# EAGLE board USBHubAndSensors (EAGLE 6.0)
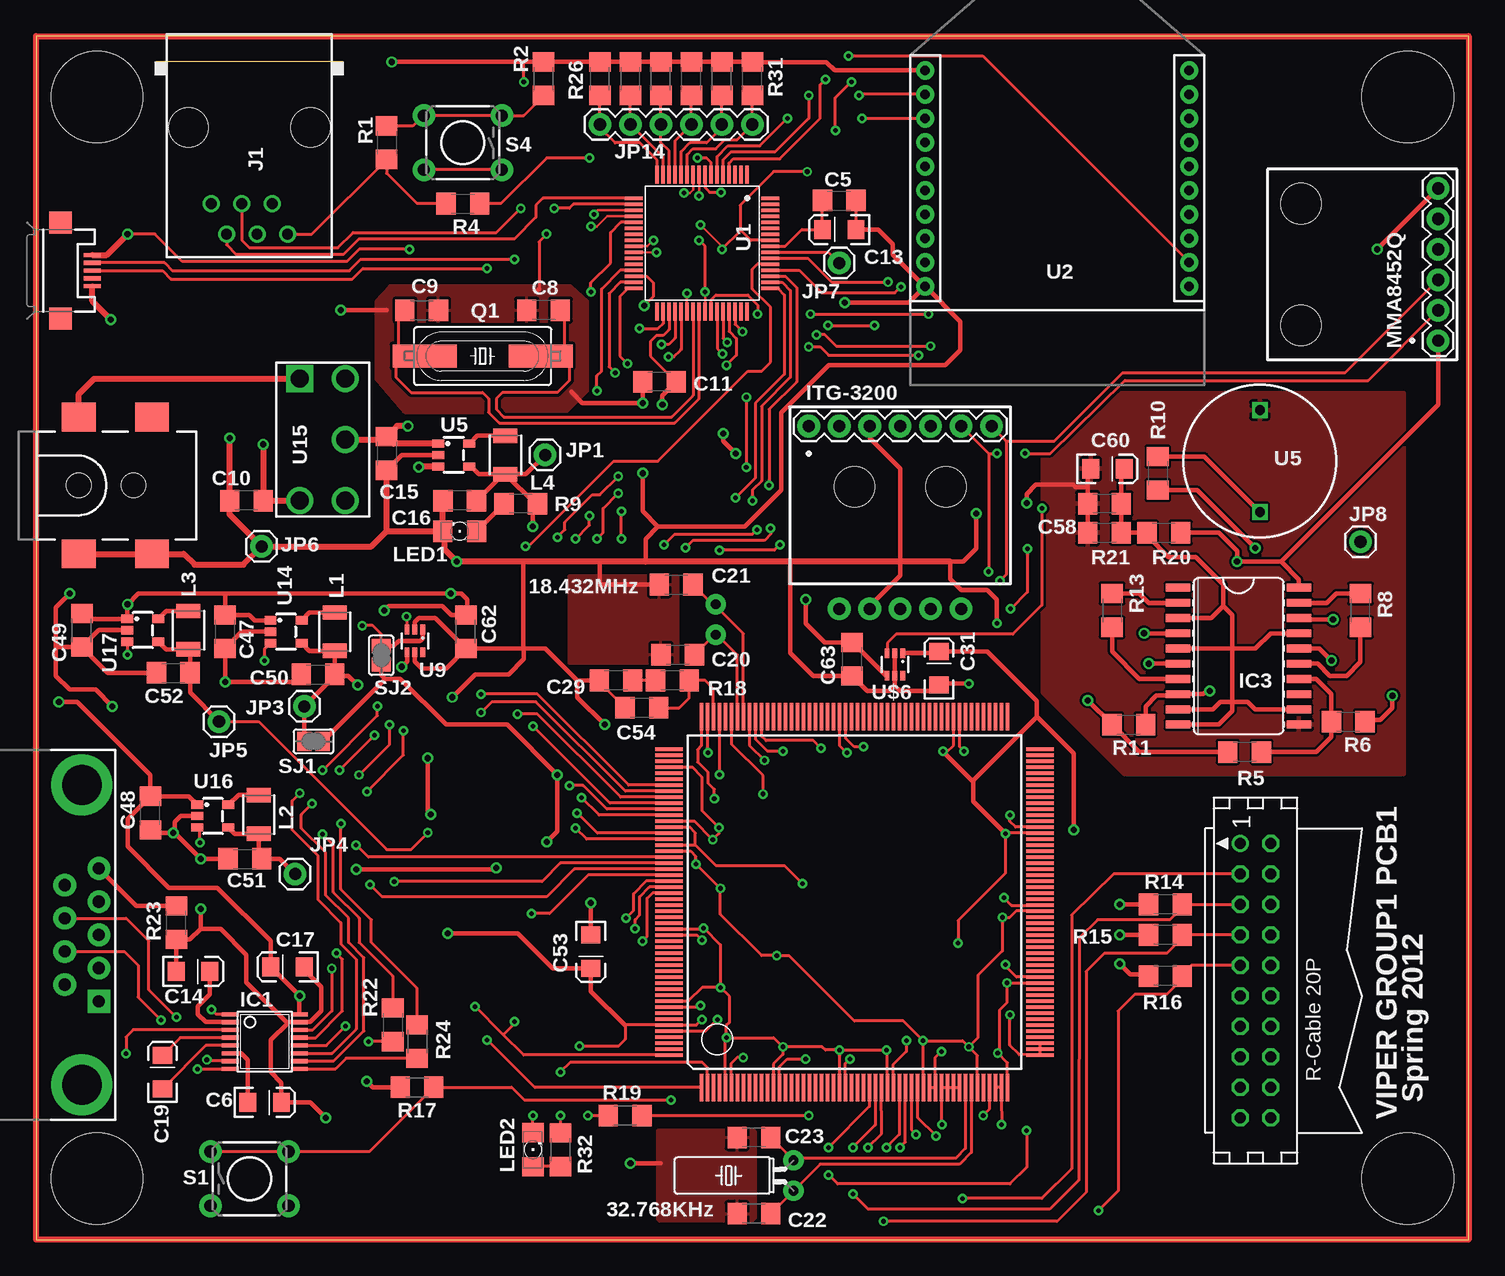
[diagram p2: board, top side]
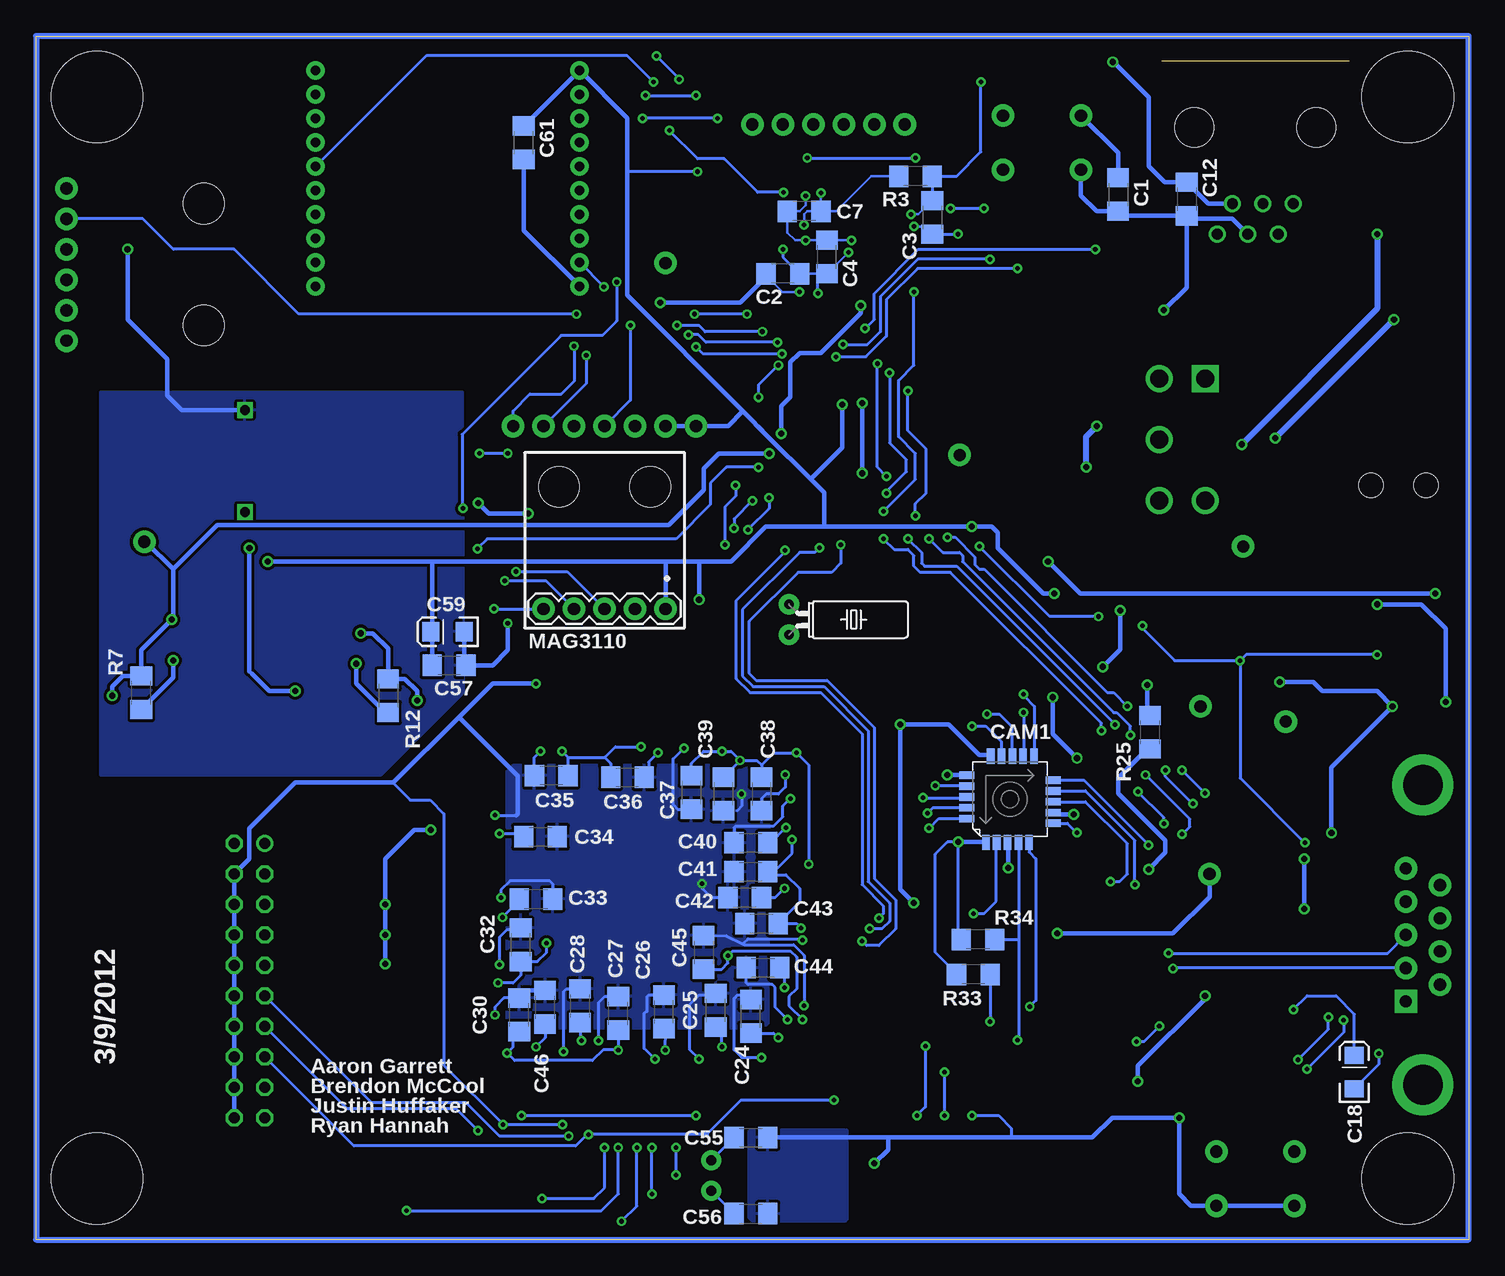
[diagram p3: board, bottom side, seen from below]

Size 119.38 x 100.33 mm. Coordinates in mm from the lower left corner, seen from the top.
Outline: 0,0 119.38,0 119.38,100.33 0,100.33 0,0
Copper layers (1*16): Top 0.035mm / dielectric 1.5mm / Bottom 0.035mm
Design rules: minimum track width 8mil, minimum drill 15mil, track to track 8mil, track to pad 8mil, pad to pad 6mil, via to via 8mil, smd to smd 8mil, copper to edge 40mil, drill to drill 8mil, minimum pad ring 10mil, minimum via ring 8mil, stop-mask expansion 4mil, vias tented up to drill 0mil, thermal gap 10mil
Holes 7.62 mm at 5.08,95.25 5.08,5.08 114.3,95.25 114.3,5.08
Holes 3.37 mm at 105.41,86.36 105.41,76.2 68.2,62.74 75.82,62.74

## Footprints (pad centres in the part's own frame; a part is rotated, then mirrored left to right if it is on the bottom)
TC38H = drill 0.813 pad 1.676: 1 -1.27,0; 2 1.27,0
1206 = smd 1.6 x 1.8: 1 -1.4,0; 2 1.4,0
EIA3216 = smd 1.4 x 1.6: A 1.4,0; C -1.4,0
TCM8230MD = smd 0.635 x 1.27: 1 2,3.6; 2 1.1,3.6; 3 0.2,3.6; 4 -0.7,3.6; 5 -1.6,3.6; 11 -2,-3.6; 12 -1.1,-3.6; 13 -0.2,-3.6; 14 0.7,-3.6; 15 1.6,-3.6 | smd 1.27 x 0.635: 6 -3.6,2; 7 -3.6,1.1; 8 -3.6,0.2; 9 -3.6,-0.7; 10 -3.6,-1.6; 16 3.6,-2; 17 3.6,-1.1; 18 3.6,-0.2; 19 3.6,0.7; 20 3.6,1.6
CON20 = drill 0.914: 1 -11.43,-1.27 | drill 0.914 octagon: 2 -11.43,1.27; 3 -8.89,-1.27; 4 -8.89,1.27; 5 -6.35,-1.27; 6 -6.35,1.27; 7 -3.81,-1.27; 8 -3.81,1.27; 9 -1.27,-1.27; 10 -1.27,1.27; 11 1.27,-1.27; 12 1.27,1.27; 13 3.81,-1.27; 14 3.81,1.27; 15 6.35,-1.27; 16 6.35,1.27; 17 8.89,-1.27; 18 8.89,1.27; 19 11.43,-1.27; 20 11.43,1.27
TSSOP16 = smd 0.35 x 1.4: 1 -2.275,-2.875; 2 -1.625,-2.875; 3 -0.975,-2.875; 4 -0.325,-2.875; 5 0.325,-2.875; 6 0.975,-2.875; 7 1.625,-2.875; 8 2.275,-2.875; 9 2.275,2.875; 10 1.625,2.875; 11 0.975,2.875; 12 0.325,2.875; 13 -0.325,2.875; 14 -0.975,2.875; 15 -1.625,2.875; 16 -2.275,2.875
SO20L = smd 0.66 x 2.032: 1 -5.715,-5.029; 2 -4.445,-5.029; 3 -3.175,-5.029; 4 -1.905,-5.029; 5 -0.635,-5.029; 6 0.635,-5.029; 7 1.905,-5.029; 8 3.175,-5.029; 9 4.445,-5.029; 10 5.715,-5.029; 11 5.715,5.029; 12 4.445,5.029; 13 3.175,5.029; 14 1.905,5.029; 15 0.635,5.029; 16 -0.635,5.029; 17 -1.905,5.029; 18 -3.175,5.029; 19 -4.445,5.029; 20 -5.715,5.029
RJ11-NO_SHIELD = drill 0.9 pad 1.4: 1 -3.175,8.89; 2 -1.905,6.35; 3 -0.635,8.89; 4 0.635,6.35; 5 1.905,8.89; 6 3.175,6.35 | hole 3.251: -5.08,0; 5.08,0
POWER_JACK_SMD = smd 2.8 x 2.4: GND 0,-5.7; P$4 6.1,-5.7; VIN0 0,5.7; VIN1 6.1,5.7 | hole 2.032: 0,0; 4.572,0
1X01 = drill 1.016 pad 1.88: 1 0,0
1X07 = drill 1.016 pad 1.88: 1 0,0; 2 2.54,0; 3 5.08,0; 4 7.62,0; 5 10.16,0; 6 12.7,0; 7 15.24,0
1X06 = drill 1.016 pad 1.88: 1 0,0; 2 2.54,0; 3 5.08,0; 4 7.62,0; 5 10.16,0; 6 12.7,0
1X05 = drill 1.016 pad 1.88: 1 0,0; 2 2.54,0; 3 5.08,0; 4 7.62,0; 5 10.16,0
1210 = smd 1.2 x 2: 1 -1.6,0; 2 1.6,0
FKIT-LED-1206 = smd 1.6 x 1.803: A -1.422,0; C 1.422,0
HC49UP = smd 5.334 x 1.93: 1 -4.826,0; 2 4.826,0
TACTILE-PTH = drill 1.016 pad 1.88: 1 -3.251,2.261; 2 3.251,2.261; 3 -3.251,-2.261; 4 3.251,-2.261
SJ = smd 1.168 x 1.6: 1 -0.762,0; 2 0.762,0
64-TQFP = smd 1.5 x 0.3: P$1 -5.7,3.75; P$2 -5.7,3.25; P$3 -5.7,2.75; P$4 -5.7,2.25; P$5 -5.7,1.75; P$6 -5.7,1.25; P$7 -5.7,0.75; P$8 -5.7,0.25; P$9 -5.7,-0.25; P$10 -5.7,-0.75; P$11 -5.7,-1.25; P$12 -5.7,-1.75; P$13 -5.7,-2.25; P$14 -5.7,-2.75; P$15 -5.7,-3.25; P$16 -5.7,-3.75; P$33 5.7,-3.75; P$34 5.7,-3.25; P$35 5.7,-2.75; P$36 5.7,-2.25; P$37 5.7,-1.75; P$38 5.7,-1.25; P$39 5.7,-0.75; P$40 5.7,-0.25; P$41 5.7,0.25; P$42 5.7,0.75; P$43 5.7,1.25; P$44 5.7,1.75; P$45 5.7,2.25; P$46 5.7,2.75; P$47 5.7,3.25; P$48 5.7,3.75 | smd 0.3 x 1.5: P$17 -3.75,-5.7; P$18 -3.25,-5.7; P$19 -2.75,-5.7; P$20 -2.25,-5.7; P$21 -1.75,-5.7; P$22 -1.25,-5.7; P$23 -0.75,-5.7; P$24 -0.25,-5.7; P$25 0.25,-5.7; P$26 0.75,-5.7; P$27 1.25,-5.7; P$28 1.75,-5.7; P$29 2.25,-5.7; P$30 2.75,-5.7; P$31 3.25,-5.7; P$32 3.75,-5.7; P$49 3.75,5.7; P$50 3.25,5.7; P$51 2.75,5.7; P$52 2.25,5.7; P$53 1.75,5.7; P$54 1.25,5.7; P$55 0.75,5.7; P$56 0.25,5.7; P$57 -0.25,5.7; P$58 -0.75,5.7; P$59 -1.25,5.7; P$60 -1.75,5.7; P$61 -2.25,5.7; P$62 -2.75,5.7; P$63 -3.25,5.7; P$64 -3.75,5.7
XBEE-SILK = drill 0.8 pad 1.524: 1 -11,20; 2 -11,18; 3 -11,16; 4 -11,14; 5 -11,12; 6 -11,10; 7 -11,8; 8 -11,6; 9 -11,4; 10 -11,2; 11 11,2; 12 11,4; 13 11,6; 14 11,8; 15 11,10; 16 11,12; 17 11,14; 18 11,16; 19 11,18; 20 11,20
40TR = drill 0.8 square: P$1 0,4.25; P$2 0,-4.25
SOT23-5 = smd 0.686 x 0.991: P$1 -0.953,-1.295; P$2 0,-1.295; P$3 0.953,-1.295; P$4 0.953,1.295; P$5 -0.953,1.295
SC-70-6 = smd 0.4 x 0.8: P$1 -0.65,-0.95; P$2 0,-0.95; P$3 0.65,-0.95; P$4 0.65,0.95; P$5 0,0.95; P$6 -0.65,0.95
PQFP208 = smd 0.3 x 2.286: 1 -12.75,-15.458; 2 -12.25,-15.458; 3 -11.75,-15.458; 4 -11.25,-15.458; 5 -10.75,-15.458; 6 -10.25,-15.458; 7 -9.75,-15.458; 8 -9.25,-15.458; 9 -8.75,-15.458; 10 -8.25,-15.458; 11 -7.75,-15.458; 12 -7.25,-15.458; 13 -6.75,-15.458; 14 -6.25,-15.458; 15 -5.75,-15.458; 16 -5.25,-15.458; 17 -4.75,-15.458; 18 -4.25,-15.458; 19 -3.75,-15.458; 20 -3.25,-15.458; 21 -2.75,-15.458; 22 -2.25,-15.458; 23 -1.75,-15.458; 24 -1.25,-15.458; 25 -0.75,-15.458; 26 -0.25,-15.458; 27 0.25,-15.458; 28 0.75,-15.458; 29 1.25,-15.458; 30 1.75,-15.458; 31 2.25,-15.458; 32 2.75,-15.458; 33 3.25,-15.458; 34 3.75,-15.458; 35 4.25,-15.458; 36 4.75,-15.458; 37 5.25,-15.458; 38 5.75,-15.458; 39 6.25,-15.458; 40 6.75,-15.458; 41 7.25,-15.458; 42 7.75,-15.458; 43 8.25,-15.458; 44 8.75,-15.458; 45 9.25,-15.458; 46 9.75,-15.458; 47 10.25,-15.458; 48 10.75,-15.458; 49 11.25,-15.458; 50 11.75,-15.458; 51 12.25,-15.458; 52 12.75,-15.458; 105 12.75,15.458; 106 12.25,15.458; 107 11.75,15.458; 108 11.25,15.458; 109 10.75,15.458; 110 10.25,15.458; 111 9.75,15.458; 112 9.25,15.458; 113 8.75,15.458; 114 8.25,15.458; 115 7.75,15.458; 116 7.25,15.458; 117 6.75,15.458; 118 6.25,15.458; 119 5.75,15.458; 120 5.25,15.458; 121 4.75,15.458; 122 4.25,15.458; 123 3.75,15.458; 124 3.25,15.458; 125 2.75,15.458; 126 2.25,15.458; 127 1.75,15.458; 128 1.25,15.458; 129 0.75,15.458; 130 0.25,15.458; 131 -0.25,15.458; 132 -0.75,15.458; 133 -1.25,15.458; 134 -1.75,15.458; 135 -2.25,15.458; 136 -2.75,15.458; 137 -3.25,15.458; 138 -3.75,15.458; 139 -4.25,15.458; 140 -4.75,15.458; 141 -5.25,15.458; 142 -5.75,15.458; 143 -6.25,15.458; 144 -6.75,15.458; 145 -7.25,15.458; 146 -7.75,15.458; 147 -8.25,15.458; 148 -8.75,15.458; 149 -9.25,15.458; 150 -9.75,15.458; 151 -10.25,15.458; 152 -10.75,15.458; 153 -11.25,15.458; 154 -11.75,15.458; 155 -12.25,15.458; 156 -12.75,15.458 | smd 2.286 x 0.3: 53 15.458,-12.75; 54 15.458,-12.25; 55 15.458,-11.75; 56 15.458,-11.25; 57 15.458,-10.75; 58 15.458,-10.25; 59 15.458,-9.75; 60 15.458,-9.25; 61 15.458,-8.75; 62 15.458,-8.25; 63 15.458,-7.75; 64 15.458,-7.25; 65 15.458,-6.75; 66 15.458,-6.25; 67 15.458,-5.75; 68 15.458,-5.25; 69 15.458,-4.75; 70 15.458,-4.25; 71 15.458,-3.75; 72 15.458,-3.25; 73 15.458,-2.75; 74 15.458,-2.25; 75 15.458,-1.75; 76 15.458,-1.25; 77 15.458,-0.75; 78 15.458,-0.25; 79 15.458,0.25; 80 15.458,0.75; 81 15.458,1.25; 82 15.458,1.75; 83 15.458,2.25; 84 15.458,2.75; 85 15.458,3.25; 86 15.458,3.75; 87 15.458,4.25; 88 15.458,4.75; 89 15.458,5.25; 90 15.458,5.75; 91 15.458,6.25; 92 15.458,6.75; 93 15.458,7.25; 94 15.458,7.75; 95 15.458,8.25; 96 15.458,8.75; 97 15.458,9.25; 98 15.458,9.75; 99 15.458,10.25; 100 15.458,10.75; 101 15.458,11.25; 102 15.458,11.75; 103 15.458,12.25; 104 15.458,12.75; 157 -15.458,12.75; 158 -15.458,12.25; 159 -15.458,11.75; 160 -15.458,11.25; 161 -15.458,10.75; 162 -15.458,10.25; 163 -15.458,9.75; 164 -15.458,9.25; 165 -15.458,8.75; 166 -15.458,8.25; 167 -15.458,7.75; 168 -15.458,7.25; 169 -15.458,6.75; 170 -15.458,6.25; 171 -15.458,5.75; 172 -15.458,5.25; 173 -15.458,4.75; 174 -15.458,4.25; 175 -15.458,3.75; 176 -15.458,3.25; 177 -15.458,2.75; 178 -15.458,2.25; 179 -15.458,1.75; 180 -15.458,1.25; 181 -15.458,0.75; 182 -15.458,0.25; 183 -15.458,-0.25; 184 -15.458,-0.75; 185 -15.458,-1.25; 186 -15.458,-1.75; 187 -15.458,-2.25; 188 -15.458,-2.75; 189 -15.458,-3.25; 190 -15.458,-3.75; 191 -15.458,-4.25; 192 -15.458,-4.75; 193 -15.458,-5.25; 194 -15.458,-5.75; 195 -15.458,-6.25; 196 -15.458,-6.75; 197 -15.458,-7.25; 198 -15.458,-7.75; 199 -15.458,-8.25; 200 -15.458,-8.75; 201 -15.458,-9.25; 202 -15.458,-9.75; 203 -15.458,-10.25; 204 -15.458,-10.75; 205 -15.458,-11.25; 206 -15.458,-11.75; 207 -15.458,-12.25; 208 -15.458,-12.75
G-197 = drill 1.5 square: P$1 -5.08,-1.905 | drill 1.5: P$2 5.08,-1.905; P$3 5.08,1.905; P$4 -5.08,1.905; P$5 0,1.905
DB9 = drill 1.016 pad 1.88 square: 1 -5.54,-1.42 | drill 1.016 pad 1.88: 2 -2.77,-1.42; 3 0,-1.42; 4 2.77,-1.42; 5 5.54,-1.42; 6 -4.15,1.42; 7 -1.38,1.42; 8 1.38,1.42; 9 4.15,1.42 | drill 3.302 pad 5.08: G1 -12.5,0; G2 12.5,0
USB-MICROB = smd 0.35 x 1.4: D+ 0,2.65; D- -0.65,2.65; GND 1.3,2.65; ID 0.65,2.65; VBUS -1.3,2.65 | smd 1.8 x 1.9: MT1 -4,0; MT2 4,0

## Placement (x,y rotation side)
300-8444-ND  18.432MHz  [TC38H]  56.64,51.69 270 bottom
535-9034-ND  32.768kHz  [TC38H]  63.12,5.33 90 top
C1  0.1uf  [1206]  29.21,87.12 270 bottom
C2  0.1uf  [1206]  57.15,80.52 180 bottom
C3  0.1uf  [1206]  44.7,85.22 270 bottom
C4  0.1uf  [1206]  53.47,81.92 90 bottom
C5  0.1uf  [1206]  66.93,86.61 0 top
C6  0.1uf  [EIA3216]  19.05,11.43 0 top
C7  0.1uf  [1206]  55.37,85.72 180 bottom
C8  22pf  [1206]  42.29,77.47 180 top
C9  22pf  [1206]  32.13,77.47 0 top
C10  1uf  [1206]  17.53,61.59 180 top
C11  0.1uf  [1206]  51.94,71.5 180 top
C12  0.1uf  [1206]  23.5,86.74 270 bottom
C13  10uf  [EIA3216]  66.93,84.2 180 top
C14  0.1uf  [EIA3216]  13.08,22.35 0 top
C15  4.7uF  [1206]  29.21,65.53 270 top
C16  10uf  [1206]  35.31,61.59 180 top
C17  0.1uf  [EIA3216]  20.95,22.73 180 top
C18  0.1uf  [EIA3216]  9.53,13.97 90 bottom
C19  0.1uf  [EIA3216]  10.54,13.97 90 top
C20  10pF  [1206]  53.47,48.77 0 top
C21  10pF  [1206]  53.34,54.61 0 top
C22  10pF  [1206]  59.82,2.16 180 top
C23  10pF  [1206]  59.82,8.51 180 top
C24  100nF  [1206]  59.82,18.61 90 bottom
C25  100nF  [1206]  62.74,19.11 90 bottom
C26  100nF  [1206]  67.06,18.99 90 bottom
C27  100nF  [1206]  70.87,18.86 90 bottom
C28  100nF  [1206]  74.04,19.49 90 bottom
C29  10nf  [1206]  48.32,46.61 180 top
C30  100nF  [1206]  79.12,18.73 90 bottom
C31  10uf  [EIA3216]  75.25,47.62 90 top
C32  100nF  [1206]  78.99,24.57 90 bottom
C33  100nF  [1206]  77.72,28.38 0 bottom
C34  100nF  [1206]  77.34,33.59 0 bottom
C35  100nF  [1206]  76.45,38.67 180 bottom
C36  100nF  [1206]  70.1,38.54 0 bottom
C37  100nF  [1206]  64.77,37.27 270 bottom
C38  100nF  [1206]  58.93,37.15 270 bottom
C39  100nF  [1206]  62.1,37.15 270 bottom
C40  100nF  [1206]  59.82,33.08 0 bottom
C41  100nF  [1206]  59.82,30.67 0 bottom
C42  100nF  [1206]  60.33,28.51 0 bottom
C43  100nF  [1206]  58.93,26.35 0 bottom
C44  100nF  [1206]  58.8,22.67 0 bottom
C45  100nF  [1206]  63.75,23.94 270 bottom
C46  100nF  [1206]  76.96,19.37 90 bottom
C47  4.7uF  [1206]  15.75,50.67 90 top
C48  4.7uF  [1206]  9.53,35.56 90 top
C49  4.7uF  [1206]  3.81,50.8 90 top
C50  10uF  [1206]  23.5,47.12 0 top
C51  10uf  [1206]  17.4,31.75 0 top
C52  10uf  [1206]  11.43,47.24 0 top
C53  10uf  [EIA3216]  46.23,24 270 top
C54  1nf  [1206]  50.48,44.32 180 top
C55  7pF  [1206]  59.82,8.51 0 bottom
C56  7pF  [1206]  59.82,2.16 0 bottom
C57  0.1uf  [1206]  84.96,47.88 0 bottom
C58  0.1uf  [1206]  89.03,61.34 180 top
C59  4.7uf  [EIA3216]  85.09,50.67 180 bottom
C60  4.7uf  [EIA3216]  89.28,64.26 0 top
C61  0.1uf  [1206]  78.74,91.44 90 bottom
C62  0.1uf  [1206]  35.81,50.67 90 top
C63  0.1uf  [1206]  68.01,48.39 90 top
CAM1  TCM8230MD  [TCM8230MD]  38.23,36.7 180 bottom
CON1  [CON20]  101.6,21.59 270 top
IC1  MAX3232CUE  [TSSOP16]  19.05,16.51 270 top
IC3  MAX275ACPBCWP  [SO20L]  100.2,48.64 270 top
J1  RJ11-6L-B  [RJ11-NO_SHIELD]  17.78,92.71 180 top
J2  POWER_JACKSMD  [POWER_JACK_SMD]  3.56,62.87 0 top
JP1  M01PTH  [1X01]  42.42,65.41 0 top
JP3  M01PTH  [1X01]  22.35,44.45 0 top
JP4  M01PTH  [1X01]  21.59,30.48 0 top
JP4_ITG-3200  [1X07]  64.39,67.82 0 top
JP5  M01PTH  [1X01]  15.24,43.18 0 top
JP5_MMA8452Q  [1X06]  116.84,74.93 90 top
JP6  M01PTH  [1X01]  18.8,57.78 0 top
JP6_MAG3110  [1X05]  66.93,52.58 180 bottom
JP7  M01PTH  [1X01]  66.93,81.41 180 top
JP8  M01PTH  [1X01]  110.36,58.17 0 top
JP14  [1X06]  46.99,92.96 0 top
L1  2.2uH  [1210]  24.89,50.67 270 top
L2  2.2uH  [1210]  18.54,35.43 270 top
L3  2.2uH  [1210]  12.7,50.8 270 top
L4  2.2uH  [1210]  39.12,65.41 270 top
LED1  [FKIT-LED-1206]  35.31,59.05 180 top
LED2  [FKIT-LED-1206]  41.4,7.49 90 top
Q1  8MHz  [HC49UP]  37.21,73.66 0 top
R1  370  [1206]  29.21,91.44 270 top
R2  10k  [1206]  42.29,96.77 90 top
R3  10  [1206]  46.1,88.65 180 bottom
R4  100  [1206]  35.56,86.36 0 top
R5  50k  [1206]  100.71,40.64 180 top
R6  100k  [1206]  109.35,43.18 0 top
R7  45k  [1206]  110.62,45.59 90 bottom
R8  50k  [1206]  110.36,52.45 90 top
R9  65  [1206]  40.39,61.34 180 top
R10  50k  [1206]  93.47,63.88 270 top
R11  100k  [1206]  91.06,42.93 0 top
R12  45k  [1206]  90.04,45.34 270 bottom
R13  50k  [1206]  89.66,52.45 270 top
R14  100K  [1206]  94.11,27.94 180 top
R15  100K  [1206]  94.11,25.4 180 top
R16  100K  [1206]  94.11,21.97 180 top
R17  1K  [1206]  31.75,12.7 0 top
R18  100K  [1206]  53.02,46.61 180 top
R19  100k  [1206]  49.09,10.35 0 top
R20  4.7k  [1206]  93.98,58.93 0 top
R21  4.7k  [1206]  89.03,58.93 0 top
R22  470  [1206]  29.72,17.91 270 top
R23  10  [1206]  11.68,26.42 90 top
R24  470  [1206]  31.75,16.51 270 top
R25  100K  [1206]  26.54,42.29 90 bottom
R26  10k  [1206]  46.99,96.77 90 top
R27  10k  [1206]  49.53,96.77 90 top
R28  10k  [1206]  52.07,96.77 90 top
R29  10k  [1206]  54.61,96.77 90 top
R30  10k  [1206]  57.15,96.77 90 top
R31  10k  [1206]  59.69,96.77 90 top
R32  1k  [1206]  43.69,7.49 270 top
R33  10k  [1206]  41.27,22.1 180 bottom
R34  10k  [1206]  40.89,25.02 180 bottom
S1  [TACTILE-PTH]  17.78,5.08 0 top
S4  [TACTILE-PTH]  35.56,91.44 180 top
SJ1  [SJ]  23.11,41.53 180 top
SJ2  [SJ]  28.77,48.7 90 top
U$1  PIC32MX534F06HTQFP  [64-TQFP]  55.5,83.06 270 top
U$2  XBEE-1B2  [XBEE-SILK]  85.09,77.47 0 top
U$5  40TR-12B  [40TR]  101.98,64.9 0 top
U$5_LM3671MF-3.3  LM36715  [SOT23-5]  34.8,65.41 270 top
U$6  MIC94061YC6  [SC-70-6]  71.56,47.94 180 top
U$7  AT91SAM9XE256  [PQFP208]  68.2,28.13 0 top
U$9  MIC94061YC6  [SC-70-6]  31.56,49.91 180 top
U$14_LM3671MF-2.8  LM36715  [SOT23-5]  20.83,50.67 270 top
U$15  G-107PLUG-IN  [G-197]  23.88,66.67 270 top
U$16_LM3671MF-1.8  LM36715  [SOT23-5]  14.73,35.31 270 top
U$17_LM3671-1.5  LM36715  [SOT23-5]  8.89,50.8 270 top
X1  [DB9]  3.81,25.4 90 top
X2  USB-MICROB  [USB-MICROB]  2.03,80.77 270 top

## Tracks (layer width: path | path; a pad name or v marks a point on that pad's centre or on a via)
1.8V  (via drill 0.38, 0.51)
  Top 0.254: U$7.77 81.67,27.38 81.15,26.86 v80.52,26.86 80.52,24.07 78.49,22.04 78.49,16.83 v77.72,16.07 | v77.72,16.07 78.45,15.34 U$7.47 | v73.91,16.57 77.22,16.57 v77.72,16.07 | C53.A | v45.97,10.35 R19.1 | v45.28,16.13 48.51,16.13 49.09,16.7 49.09,17.84 49.12,17.88 U$7.203 55.03,17.88 v55.5,18.35 | v62.23,40.7 60.96,40.7 59.94,41.72 59.95,41.72 U$7.147 | U$7.148 59.45,41.2 v60.71,39.94 | U$7.155 55.95,40.63 v56.01,40.58 | U$7.174 54.55,32.38 54.99,31.94 v54.99,31.3 v57.02,29.27 57.02,27.11 60.45,23.69 v61.72,23.69 62.74,23.69 68.2,18.22 72.26,18.22 v73.91,16.57 | U$7.38 73.95,16.54 v73.91,16.57
  Top 0.381: U$16_LM3671MF-1.8.P$4 16.55,33.83 L2.2 18.54,32.38 C51.2 20.32,31.75 JP4.1 | v34.29,25.53 40.13,25.53 43.05,22.61 C53.A | C53.A 46.23,20.7 49.09,17.84
  Bottom 0.254: C33.1 79.12,28.25 v80.52,26.86 | C46.1 76.96,16.83 v77.72,16.07 | C28.1 74.04,16.7 v73.91,16.57 | v54.99,31.3 54.99,39.56 v56.01,40.58 57.91,40.58 58.93,39.56 | v45.28,16.13 45.28,11.05 v45.97,10.35 | C37.1 64.77,39.69 63.75,40.7 v62.23,40.7 61.47,40.7 v60.71,39.94 | C39.1 v60.71,39.94 | v60.71,39.94 59.31,39.94 58.93,39.56 | 58.93,39.56 C38.1 | v57.02,29.27 57.78,28.51 C42.2 | v55.5,18.35 56.64,19.49 56.64,20.26 56.01,20.89 56.01,23.56 56.52,24.07 61.34,24.07 v61.72,23.69 61.72,23.05 62.23,22.54 C45.2
  Bottom 0.381: JP4.1 21.59,28.57 24.64,25.53 v34.29,25.53
2.8V  (via drill 0.51)
  Top 0.381: U$14_LM3671MF-2.8.P$4 22.77,49.07 L1.2 C50.2 24.89,46.99 | SJ1.2 JP3.1 24.89,46.99 | 24.89,46.99 26.03,46.99 v26.8,46.23
  Bottom 0.381: v26.8,46.23 26.8,43.95 R25.2
3.3V  (via drill 0.38, 0.51)
  Top 0.203: v54.23,78.87 U$1.P$38 | v51.69,82.3 U$1.P$26 | U$1.P$19 46.82,85.81 v46.48,85.47 | v57.15,82.55 57.15,82.8 v55.37,84.58 | U$1.P$10 54.75,87.52 54.48,87.25 v53.98,87.25
  Top 0.254: v64.26,89.03 61.47,89.03 58.67,86.23 58.67,84.2 | 58.67,84.2 59.57,83.31 U$1.P$57 | 58.67,84.2 58.67,84.07 v57.15,82.55 | v40.64,96.52 40.64,98.17 | U$1.P$35 52.75,75.86 52.26,75.37 51.69,75.37 51.18,74.87 51.18,73.66 C11.1
  Top 0.381: 36.91,61.59 C16.1 38.92,63.8 | 15.75,53.85 v34.54,53.85 35.43,53.85 35.94,53.34 35.94,52.2 C62.2 34.6,52.07 33.85,52.83 29.4,52.83 v29.02,52.45 | 15.75,53.85 C47.2 17.78,52.07 18.22,51.63 U$14_LM3671MF-2.8.P$1 | 15.75,53.85 8.51,53.85 v7.62,52.96 7.59,52.93 U$17_LM3671-1.5.P$1 4.45,51.75 4.13,52.07 3.94,52.07 C49.2 | C48.2 12.73,36.96 U$16_LM3671MF-1.8.P$1 | R17.1 28.07,12.7 v27.56,13.21 | v30.48,47.75 30.91,48.18 U$9.P$4 | v64.14,53.34 64.14,51.37 65.72,49.79 C63.2 | C63.2 68.12,49.79 | 74.11,97.47 U$2.1 66.55,97.47 65.85,98.17 R31.2 R30.2 R29.2 R28.2 R27.2 R26.2 R2.2 40.64,98.17 v29.66,98.17 v29.65,98.17 | v41.4,59.44 41.4,60.96 R9.1 41.58,61.34 L4.2 | L4.2 40.82,63.8 JP1.1 | L4.2 38.92,63.8 | U$6.P$4 70.86,46.99 68.07,49.78 C63.2 | R20.2 98.55,58.93 100.08,57.4 v100.08,56.52 103.76,56.52 | IC3.20 105.23,55.04 103.76,56.52 | JP5_MMA8452Q.1 116.84,69.6 103.76,56.52 | v1.91,44.83 3.43,44.83 9.53,38.73 C48.2 | C48.2 7.62,35.05 7.62,32.77 11.05,29.34 15.11,29.34 19.55,24.89 C17.A v21.97,20.32 21.93,20.28 IC1.16 | v52.2,69.6 52.2,70.36 C11.1 | 38.92,63.8 36.91,63.8 36.26,64.45 U$5_LM3671MF-3.3.P$4
  Bottom 0.203: v46.48,85.47 45.85,85.47 C3.1 | C7.1 52.7,85.72 49.78,88.65 R3.2 | C7.1 v53.97,87.25 v53.98,87.25 | v51.69,82.3 v51.69,82.29 C4.1 | 54.23,79.75 C4.1 | C2.1 C4.1 | C7.1 55.12,85.72 55.37,85.47 v55.37,84.58
  Bottom 0.254: C3.1 R3.1 42.67,88.65 40.64,90.68 v40.64,96.52 | v57.15,82.55 57.15,81.92 C2.1 | v64.26,89.03 69.98,89.03 70.1,88.9 | v54.23,78.87 54.23,79.75
  Bottom 0.381: v1.91,44.83 1.91,50.93 3.94,52.96 v7.62,52.96 | 53.72,59.44 v41.4,59.44 39.75,59.44 39.24,58.93 39.24,57.66 35.43,53.85 v34.54,53.85 | 60.48,69.06 70.1,78.74 70.1,88.9 70.1,93.48 U$2.1 78.72,92.84 C61.2 | 60.48,69.06 58.39,66.96 | 58.39,66.96 54.84,63.39 | v52.2,69.6 52.2,66.03 54.84,63.39 | 63.11,56.52 61.47,56.52 58.56,59.44 53.72,59.44 | 63.11,56.52 64.14,56.52 v64.14,53.34 | 66.93,56.52 JP6_MAG3110.1 | C57.1 86.36,50.55 C59.A 86.36,50.8 86.36,56.52 | 59.25,67.82 58.39,66.96 | v29.02,52.45 29.02,49.21 v30.48,47.75 | J1.2 21.71,86.36 C12.1 25.34,88.14 26.67,89.47 26.67,95.25 29.59,98.17 v29.65,98.17 | v100.08,56.52 86.36,56.52 | 86.36,56.52 66.93,56.52 | 66.93,56.52 63.11,56.52 | 54.84,63.39 53.72,62.27 53.72,59.44 | JP4_ITG-3200.2 JP4_ITG-3200.1 61.72,67.82 60.48,69.06 | v21.97,20.32 21.97,20.07 27.56,14.48 v27.56,13.21
5V  (via drill 0.51)
  Top 0.381: 31.94,64.45 v31.88,64.39
  Top 0.508: U$5_LM3671MF-3.3.P$3 31.94,64.45 | U$5_LM3671MF-3.3.P$1 29.79,66.36 C15.1 | v30.99,67.82 30.1,67.82 C15.1 | U$15.P$5 28.95,66.67 C15.1
  Bottom 0.508: v31.88,64.39 31.88,66.93 v30.99,67.82
AN15  (via drill 0.51)
  Top 0.254: U$1.P$30 50.88,80.31 51.44,79.76 51.44,78.61 v50.67,77.85
  Top 0.381: v108.08,51.69 105.36,51.69 IC3.18 | v57.28,67.18 57.28,66.55 v58.29,65.53 | v113.03,45.34 113.03,44.32 112.01,43.31 110.87,43.31 R6.2
  Bottom 0.381: JP8.1 110.24,58.17 107.95,55.88 | 107.95,55.88 104.27,59.56 66.67,59.56 63.75,62.48 63.75,64.26 62.48,65.53 v58.29,65.53 | v50.67,77.85 50.67,77.22 53.98,73.91 55.75,73.91 56.52,73.15 56.52,70.23 57.28,69.47 v57.28,67.18 | 107.95,55.88 107.95,51.82 v108.08,51.69 110.62,49.15 R7.2 112.14,46.99 113.03,46.1 v113.03,45.34
CAM3.3V  (via drill 0.38)
  Top 0.254: v19.05,48.26 19.05,49.24 U$14_LM3671MF-2.8.P$3 | U$17_LM3671-1.5.P$3 7.59,48.79 v7.62,48.77 | v13.65,33.08 13.65,34.14 U$16_LM3671MF-1.8.P$3 | SJ2.2 28.77,50.48 28.07,51.18 v27.18,51.18
  Top 0.381: U$9.P$1 32.21,50.12 32,49.91 30.23,49.91 29.78,49.47 SJ2.2
  Bottom 0.254: v19.05,48.26 24.51,48.26 27.18,50.93 v27.18,51.18 | v7.62,48.77 18.54,48.77 v19.05,48.26 | v19.05,48.26 19.05,38.48 v13.65,33.08
CTSDATA  (via drill 0.38)
  Top 0.254: IC1.7 14.32,14.88 v14.22,14.99 | v11.68,18.54 9.4,20.83 9.4,24.89 7.51,26.78 X1.8
  Bottom 0.254: v14.22,14.99 11.68,17.53 v11.68,18.54
GND  (via drill 0.38, 0.51)
  Top 0.203: v55.75,78.99 U$1.P$41 | U$1.P$20 47.59,85.31 46.74,84.45 v46.23,84.45 | v55.24,87 U$1.P$9 | U$1.P$25 50.93,82.81 v51.44,83.31
  Top 0.254: R23.1 | C13.C C5.2 | v80.77,22.92 80.77,22.8 81.69,21.88 U$7.66 | U$7.55 U$7.54 U$7.53 81.92,15.43 81.15,16.19 v81.15,18.73 | U$7.50 U$7.51 80.45,11.82 v80.45,9.59 | v80.64,28.51 81.28,27.88 83.14,27.88 U$7.78 | 83.12,34.38 U$7.91 81.63,34.38 81.15,34.86 v81.15,35.37 | 77.09,40.96 v77.34,40.7 76.95,41.1 U$7.113 | v65.41,40.96 64.77,41.59 60.83,41.59 60.45,41.98 U$7.146 | v72.52,16.57 72.52,15.68 71.45,14.62 U$7.33 | U$7.39 U$7.40 74.95,15.2 v75.44,15.68 | U$7.44 U$7.43 U$7.42 U$7.41 75.45,9.64 v75.5,9.59 | S4.1 S4.2 | LED2.C v41.4,10.35 | 41.91,79.25 41.91,83.19 v42.55,83.82 | v55.75,78.99 55.75,82.8 v55.24,83.31 | 49.65,44.45 C54.2 46.92,46.48 C29.2 | U$7.133 66.95,41.19 v67.56,40.58 | v60.58,37.15 60.58,38.67 57.95,41.3 U$7.151 | U$7.153 v56.95,38.74 | v56.52,36.77 56.52,37.53 56.01,38.04 56.01,38.92 55.12,39.81 55.12,40.83 55.45,41.16 U$7.156 | U$7.173 54.94,32.88 | 54.94,32.88 56.64,31.18 62.36,31.18 v63.88,29.65 | 54.94,32.88 54.94,33.9 54.46,34.38 U$7.170 | v55.5,24.96 55.07,25.38 U$7.188 | U$7.200 55.26,19.38 v55.37,19.49 | U$7.204 55.8,17.38 v56.77,18.35 | v58.93,15.18 58.42,15.18 57.95,14.71 U$7.6 | U$7.14 61.95,14.39 62.61,15.05 v64.14,15.05 | U$7.25 67.45,14.68 v67.82,15.05
  Top 0.381: 72.01,56.52 72.01,64.26 69.47,66.8 JP4_ITG-3200.3 | C14.C R23.1 | C17.C 22.36,22.48 23.75,21.08 23.75,19.05 22.83,18.14 IC1.15 21.06,18.14 20.95,18.03 | v24.13,10.16 22.86,11.43 C6.A 20.45,13.08 19.56,13.97 19.56,16.64 20.95,18.03 | U$14_LM3671MF-2.8.P$2 17.15,50.67 C47.1 v15.75,46.48 21.46,46.48 C50.1 | C52.1 5.97,47.24 C49.1 | 1.65,49.53 1.65,46.99 2.79,45.85 4.95,45.85 v6.35,44.45 | C51.1 v13.72,31.75 11.56,33.91 | v25.4,77.47 29.21,77.47 | C11.2 v50.55,69.72 45.53,69.72 44.58,70.67 | C21.1 46.99,54.61 46.99,56.52 | 51.82,59.44 58.8,59.44 59.05,59.44 62.1,62.48 62.1,68.96 66.04,72.9 75.75,72.9 77.03,74.17 77.03,76.53 U$2.10 | R21.1 C58.2 87.63,64.01 C60.C | v111.76,82.55 JP5_MMA8452Q.6 | 71.56,46.16 U$6.P$5 U$6.P$2 | 71.56,46.16 72.01,45.72 74.74,45.72 C31.C 75.31,46.35 v77.72,46.35 | 62.87,56.52 62.87,48.9 64.77,46.99 C63.1 | U$17_LM3671-1.5.P$2 5.21,50.8 C49.1 | C49.1 1.78,49.4 1.65,49.53 | 41.91,79.25 41.85,79.19 | U$2.10 74.09,79.42 74.04,79.42 | 74.04,79.42 74.12,79.42 | 74.04,79.42 74.04,79.44 71.37,82.11 71.37,83 70.17,84.2 C13.C | v67.37,78.11 72.72,78.11 U$2.10 | 51.82,59.44 50.8,58.42 50.8,56.52 | 51.82,59.44 50.55,60.72 v50.55,63.88 | v80.07,51.37 80.07,53.34 79.25,54.17 77.09,54.17 76.2,55.05 76.2,56.52 77.28,56.52 78.36,57.59 v78.36,60.52 | v82.55,61.4 82.55,62.17 83.31,62.93 86.42,62.93 86.61,62.74 87.63,62.74 C58.2 | U$5_LM3671MF-3.3.P$2 30.48,65.41 C15.2 | 40.6,56.52 40.6,49.36 40.64,49.28 | 40.64,49.28 C62.1 | 40.64,49.28 42.42,49.28 45.09,46.61 | 45.09,46.61 C29.2 | 40.64,49.28 40.64,48.39 39.37,47.12 36.58,47.12 v34.67,45.21 | v32.64,40.13 32.64,35.69 v32.89,35.43
  Top 0.381: 45.09,46.61 45.09,45.21 v47.37,42.93 | v46.23,28.07 C53.C | U$9.P$5 31.56,48.2 32.13,47.62 34.17,47.62 C62.1 | U$9.P$2 31.56,51.5 31.88,51.82 33.27,51.82 C62.1 | C48.1 9.78,33.91 v11.43,33.91 11.56,33.91 | v2.79,53.85 1.65,52.7 1.65,49.53 | 13.72,27.43 v13.72,27.56 13.72,25.91 | R23.1 12.82,25.02 13.72,25.91 | 13.72,25.91 15.37,25.91 17.53,23.75 17.53,21.46 20.95,18.03 | v49.53,6.35 52.07,6.35 | JP6_MAG3110.2 69.47,52.83 72.01,55.37 72.01,56.39 71.88,56.52 | 11.56,33.91 11.56,34.8 12.06,35.31 U$16_LM3671MF-1.8.P$2 | C63.1 68.2,46.99 | 71.56,46.16 71.12,45.72 69.28,45.72 C63.1
  Top 0.508: J2.GND J2.P$4 12.3,57.16 13.21,56.26 17.27,56.26 JP6.1 | v16.13,66.8 C10.2 16.13,60.45 JP6.1 | 76.2,56.52 72.01,56.52 71.88,56.52 62.87,56.52 50.8,56.52 46.99,56.52 40.6,56.52 v35.05,56.52 34.04,57.53 34.04,58.42 | 34.04,58.42 34.04,58.9 LED1.C 33.88,61.57 C16.2 | JP6.1 27.94,57.78 29.21,59.05 | 29.21,59.05 33.4,59.05 34.04,58.42 | 29.21,59.05 C15.2 | v6.22,76.71 4.68,78.25 X2.GND
  Bottom 0.203: v46.23,84.45 45.34,84.45 C3.2 | v51.44,83.31 C4.2 v55.24,83.31 56.13,83.31 56.77,83.95 C7.2 55.75,85.72 55.24,86.23 v55.24,87 | 58.55,80.14 C2.2 58.55,80.39 57.15,78.99 v55.75,78.99
  Bottom 0.254: 23.24,85.09 C12.2 | v80.77,22.92 80.77,25.21 80.14,25.84 79.88,25.84 | v80.64,28.51 80.64,29.15 79.88,29.91 76.58,29.91 76.33,29.65 C33.2 | C34.2 76.32,34.22 | C35.2 77.85,40.19 v77.34,40.7 | C37.2 65.91,35.88 66.29,36.26 66.29,40.07 v65.41,40.96 | C27.2 71.12,20.26 | v72.52,16.57 72.52,19.75 72.01,20.26 71.12,20.26 70.99,20.38 | C45.1 61.85,25.34 60.48,24.65 | 60.48,24.65 60.33,24.57 56.26,24.57 55.37,23.69 v55.37,19.49 | v75.44,15.68 75.44,20.64 75.18,20.89 C28.2 | v41.4,10.35 39.18,10.35 38.1,9.27 38.1,8.51 | C3.2 v42.55,83.82 | v75.5,9.59 v80.45,9.59 85.41,14.54 85.41,35.5 86.55,36.64 88.2,36.64 89.66,38.1 | v81.15,35.37 79.38,35.37 | v67.56,40.58 68.33,39.81 68.33,38.92 C36.2 | v56.95,38.74 56.95,37.73 57.53,37.15 58.55,37.15 58.93,36.77 C38.2 | v56.52,36.77 57.15,36.13 57.15,35.24 57.91,34.48 61.09,34.48 61.21,34.35 C40.1 | v63.88,29.65 63.88,29.27 63.12,28.51 C42.1 | v55.5,24.96 55.63,25.08 60.05,25.08 60.48,24.65 | v56.77,18.35 57.78,19.37 57.78,21.02 58.04,21.27 60.07,21.27 60.2,21.4 C44.1 | v58.93,15.18 60.58,15.18 61.21,15.81 61.21,20.13 60.96,20.38 59.82,20.38 59.69,20.26 | v64.14,15.05 64.9,15.81 64.9,19.62 64.14,20.38 63.37,20.38 | v67.82,15.05 68.71,15.94 68.71,18.86 68.45,19.11 | C30.2 80.39,20.13 81.15,19.37 v81.15,18.73 | 79.88,25.84 78.99,25.84 78.61,25.46 | C32.2 79.88,25.85 79.88,25.84 | 68.45,18.99 68.45,20.26 68.33,20.38 67.18,20.38 67.18,20.39 C26.2 | v60.58,37.15 60.58,36.13 60.96,35.75
  Bottom 0.381: S1.3 S1.4 23.14,2.82 24.13,3.81 v24.13,10.16 29.72,10.16 31.37,8.51 38.1,8.51 48.38,8.51 | v2.79,53.85 32.38,53.85 v35.05,56.52 | v13.72,27.56 v13.72,31.75 | v25.4,77.47 23.5,79.38 C12.2 28.83,85.34 C1.2 30.98,85.72 32.31,87.05 S4.2 | v50.55,69.72 v50.55,63.88 | C59.C 83.69,48.01 C57.2 81.34,47.88 80.07,49.15 v80.07,51.37 | U$5.P$1 107.25,69.15 108.46,70.36 108.46,73.41 111.76,76.71 v111.76,82.55 | C55.2 48.38,8.51 | C30.2 78.49,20.77 C46.2 | CON1.20 CON1.18 CON1.16 CON1.14 CON1.12 CON1.10 CON1.8 CON1.6 CON1.4 101.6,31.75 101.6,34.29 97.79,38.1 89.66,38.1 89.6,38.1 84.17,43.53 | 23.24,85.09 19.68,85.09 J1.3 | v78.36,60.52 81.66,60.52 v82.55,61.4 | v34.67,45.21 34.67,42.16 v32.64,40.13 | v32.89,35.43 34.46,35.43 CAM1.7 | CAM1.15 39.91,40.39 40.77,40.39 43.31,42.93 v47.37,42.93 47.37,29.21 v46.23,28.07 | v11.43,33.91 11.43,39.37 v6.35,44.45 7.62,45.72 12.19,45.72 12.95,46.48 v15.75,46.48 | 48.38,8.51 48.38,7.5 v49.53,6.35 | v77.72,46.35 81.34,46.35 84.17,43.53 | 79.25,38.67 79.25,35.5 79.38,35.37 | C61.1 78.74,84.12 U$2.10 | C2.2 58.55,80.26 60.71,78.11 v67.37,78.11 | 84.17,43.53 84.11,43.53 79.31,38.73
  Bottom 0.508: v6.22,76.71 v16.13,66.8
  pour Top (isolate 0.254): 37.21,70.74 31.5,70.74 29.97,72.26 29.97,76.2 30.35,76.58 43.94,76.58 44.07,76.45 44.07,71.37 43.56,70.87 38.73,70.87 38.23,70.36 38.23,69.09 38.35,68.96 44.2,68.96 45.97,70.74 45.97,78.23 44.58,79.5 29.46,79.5 28.32,78.23 28.32,71.75 30.73,68.96 37.34,68.96 37.72,69.72 37.72,70.23
  pour Top (isolate 0.254): 53.47,55.37 53.47,48.01 44.45,48.01 44.45,55.37
  pour Top (isolate 0.254): 51.82,9.14 59.82,9.14 59.94,9.02 59.94,1.78 59.69,1.52 51.94,1.52 51.82,1.65
  pour Bottom (isolate 0.254): 58.29,38.16 58.42,17.97 58.8,17.59 80.01,17.59 80.14,18.48 80.14,39.05 79.63,39.56 59.69,39.56
  pour Bottom (isolate 0.254): 83.82,70.61 114.05,70.61 114.05,38.73 90.61,38.73 83.76,45.59
  pour Bottom (isolate 0.254): 59.88,9.14 51.82,9.14 51.82,1.65 51.94,1.52 59.69,1.52 59.94,1.78 59.94,9.08
  pour Top: 83.88,70.55 113.98,70.55 113.98,38.8 90.68,38.8 83.88,45.59
INT0  (via drill 0.38)
  Top 0.254: U$1.P$46 58.25,76.31 v58.86,75.69 | v65.98,76.2 v69.85,76.2
  Bottom 0.254: v58.86,75.69 63.63,75.69 64.14,76.2 v65.98,76.2 | v69.85,76.2 69.85,69.98 JP4_ITG-3200.4
INT1  (via drill 0.38)
  Top 0.254: U$1.P$42 56.25,78.35 56.64,78.74 59.31,78.74 60.13,77.92 v60.13,77.15 | v64.52,77.15 v74.36,77.15
  Bottom 0.254: v60.13,77.15 v64.52,77.15 | v74.36,77.15 97.47,77.15 102.87,82.55 107.95,82.55 110.49,85.09 JP5_MMA8452Q.5
INT4  (via drill 0.38)
  Top 0.254: U$1.P$45 57.75,75.73 58.36,75.12 58.36,73.72 v57.53,72.9 | v59.18,70.23 v59.18,64.39 | v82.61,57.59 82.61,53.98 v81.22,52.58
  Bottom 0.254: v57.53,72.9 59.18,71.25 v59.18,70.23 | v59.18,64.39 61.85,64.39 63.18,63.06 63.18,61.28 66.04,58.42 81.79,58.42 v82.61,57.59 | v81.22,52.58 JP6_MAG3110.5
N$1
  Top 0.254: R2.1 40.62,93.7 S4.3 S4.4 32.23,93.7 31.37,92.84 R1.1
  Bottom 0.381: C1.1 29.21,90.6 S4.4
N$2  (via drill 0.38, 0.51)
  Top 0.254: v66.95,15.81 66.95,13.52 U$7.24 | 67.06,15.81 v66.95,15.81 | v66.95,15.81 v70.87,15.81 70.95,15.73 U$7.32 | U$7.65 83.13,21.4 v80.9,21.4 80.9,19.75 80.26,19.11 80.26,15.68 v80.14,15.56 80.95,14.74 U$7.52 | U$7.199 54.36,19.88 55.5,21.02 v57.02,21.02 | U$7.187 55.53,25.88 v55.63,25.97 57.02,24.57 v57.02,21.02 | v75.56,40.7 75.95,40.7 76.45,41.21 76.45,41.22 U$7.114 | v76.83,24.7 76.83,26.61 80.77,30.54 v80.77,33.85 80.81,33.88 U$7.90 | v68.96,41.08 68.2,41.08 67.45,41.83 U$7.132 | U$7.160 54.66,39.38 55.5,38.54 55.5,35.75 v56.9,34.35 56.9,33.85 v56.39,33.34 54.84,34.88 U$7.169 | U$7.5 57.45,16.75 v57.53,16.83 | v57.53,16.83 57.53,17.84 57.78,18.1 57.78,20.26 v57.02,21.02 | v57.53,16.83 61.47,16.83 v62.23,16.07 | v62.23,16.07 62.23,15.43 61.45,14.65 U$7.13 | v66.95,15.81 65.79,15.81 65.53,16.07 v62.23,16.07
  Top 0.381: R15.2 v90.3,25.4 | R14.2 v90.3,27.94 | v90.3,22.99 91.19,22.1 92.58,22.1 R16.2 | v86.49,34.16 86.49,40.51 83.44,43.56 83.38,43.56 | 78.11,38.16 v75.56,40.7 | 78.11,38.16 78.11,38.29 83.38,43.56 | 78.11,38.16 78.11,36.54 80.77,33.88 v80.77,33.85 | U$6.P$1 75.05,48.9 C31.A 79.25,49.02 83.38,44.9 83.38,43.56
  Bottom 0.254: C35.1 75.05,37.91 | C41.2 58.17,30.67 | C43.2 56.01,26.35 v55.63,25.97 | C43.2 57.4,26.35 | C41.2 58.16,30.42 56.9,30.42 55.75,29.27 55.75,28.13 C43.2 | C35.1 | v76.83,24.7 76.83,23.94 77.6,23.17 C32.1 78.99,22.04 79.63,21.4 v80.9,21.4 | v75.56,40.7 75.05,40.19 | C35.1 75.05,40.19 | 75.05,40.19 72.01,40.19 | 72.01,40.19 71.5,39.69 C36.1 | v68.96,41.08 71.11,41.08 72.01,40.19 | v80.77,33.85 79,33.85 C34.1 | C43.2 | C43.2 | C41.2 | C40.2 58.17,33.08 v56.9,34.35 | C41.2 57.91,30.67 56.39,32.19 v56.39,33.34 | C24.1 57.91,17.21 v57.53,16.83 | v62.23,16.07 62.23,17.21 C25.1 | v66.95,15.81 66.93,17.46 C26.1 | C27.1 v70.87,15.81 72.14,15.81 73.03,14.92 79.5,14.92 v80.14,15.56 79.63,16.07 79.63,16.82 C30.1 | C44.2 57.4,22.41 57.02,22.04 v57.02,21.02
  Bottom 0.381: v86.49,34.16 87.88,34.16 90.3,31.75 v90.3,27.94 v90.3,25.4 v90.3,22.99
N$3  (via drill 0.38)
  Top 0.254: J1.4 17.14,83.31 17.78,82.68 25.15,82.68 26.42,83.95 38.35,83.95 v40.39,85.98 | U$1.P$18 44.78,86.31 44.45,85.98 v43.18,85.98
  Bottom 0.254: v43.18,85.98 v40.39,85.98
N$4
  Top 0.254: U$1.P$40 55.24,70.1 53.21,68.07 38.61,68.07 37.72,68.96 37.72,70.1 37.21,70.61 31.24,70.61 29.97,71.88 29.97,72.9 30.73,73.66 Q1.1 30.1,73.66 29.97,73.91 29.97,74.3 30.1,74.42 30.23,74.42 30.23,76.97 C9.1
N$5
  Top 0.254: Q1.2 43.05,73.66 | 43.05,73.66 44.07,74.55 44.07,77.09 C8.1 | 43.05,73.66 43.94,73.66 44.45,73.15 44.45,71.63 43.43,70.61 38.86,70.61 38.35,70.1 38.35,69.22 38.99,68.58 52.96,68.58 54.75,70.37 U$1.P$39
N$6  (via drill 0.38)
  Top 0.254: U$1.P$7 56.26,88.77 56.26,89.79 55.88,90.17 v55.12,90.17 | v46.1,90.17 42.55,90.17 38.73,86.36 R4.2
  Bottom 0.254: v55.12,90.17 v46.1,90.17
N$7
  Top 0.254: U$1.P$17 42.23,86.81 41.66,86.23 41.66,85.22 39.88,83.44 26.92,83.44 25.65,82.17 16.64,82.17 15.88,82.93 J1.5
N$8
  Top 0.381: L4.1 36.78,67 36.13,66.36 U$5_LM3671MF-3.3.P$5
N$9  (via drill 0.38)
  Top 0.254: U$1.P$6 56.75,90.28 57.66,91.19 60.33,91.19 v62.61,93.47 | v68.83,93.47 U$2.3
  Bottom 0.254: v62.61,93.47 v68.83,93.47
N$10  (via drill 0.38)
  Top 0.254: IC1.1 15,18.79 v14.61,19.18
  Bottom 0.254: v14.61,19.18 13.46,20.32 11.05,20.32 9.53,18.8 C18.A
N$11  (via drill 0.38)
  Top 0.254: IC1.3 8.09,17.48 7.49,16.89 v7.49,15.49
  Bottom 0.254: v7.49,15.49 7.49,14.61 9.14,12.95 C18.C
N$12
  Top 0.254: IC1.4 12.01,16.84 C19.A
N$13
  Top 0.254: C5.1 C13.A 63.82,84.2 62.42,82.81 U$1.P$56
N$14  (via drill 0.38)
  Top 0.254: 52.2,74.61 v52.13,74.61 52.7,74.61 53.25,75.16 U$1.P$36 | v39.88,81.72 27.05,81.72 26.1,80.77 11.37,80.77 10.72,81.42 X2.D-
  Bottom 0.254: v39.88,81.72 45.91,81.72 49.02,78.61 49.02,75.69 50.1,74.61 v52.13,74.61
N$15  (via drill 0.38)
  Top 0.254: v52.7,73.6 53.15,73.6 53.72,74.17 53.75,74.27 U$1.P$37 | v37.59,80.96 27.24,80.96 26.35,80.07 11.24,80.07 10.54,80.77 X2.D+
  Bottom 0.254: v37.59,80.96 45.91,80.96 48.51,78.36 48.51,75.31 50.23,73.6 v52.7,73.6
N$16
  Top 0.254: IC1.5 14.16,16.18 C19.C
N$17  (via drill 0.38)
  Top 0.254: U$1.P$5 57.25,90.02 57.91,90.68 61.59,90.68 64.39,93.47 v64.39,95.38 | U$2.2 68.67,95.47 v68.58,95.38
  Bottom 0.254: v68.58,95.38 v64.39,95.38
N$18  (via drill 0.38)
  Top 0.254: U$1.P$8 55.75,87.7 56.13,87.31 v57.09,87.31 | v66.61,92.46 66.61,95.19 v67.94,96.52
  Bottom 0.254: v57.09,87.31 59.24,87.31 62.04,90.11 64.26,90.11 v66.61,92.46 | v67.94,96.52 70.1,98.68 86.88,98.68 U$2.16
N$19  (via drill 0.38)
  Top 0.254: U$1.P$4 57.75,89.75 58.1,90.11 61.98,90.11 65.34,93.47 65.34,96.27 v65.79,96.71 | v67.69,98.68 78.88,98.68 U$2.12
  Bottom 0.254: v65.79,96.71 65.79,96.77 v67.69,98.68
N$20  (via drill 0.38)
  Top 0.254: U$7.37 73.45,10.18 v74.99,8.64
  Bottom 0.254: CON1.11 91.44,11.43 83.57,11.43 80.77,8.64 v74.99,8.64
N$21
  Top 0.254: R1.2 | J1.1 22.99,83.82 R1.2 | R4.1 31.75,86.36 29.21,88.9 R1.2
N$22  (via drill 0.51)
  Top 0.381: v26.67,30.86 38.23,30.86 v38.35,30.99
  Bottom 0.381: R25.1 26.8,40.89 29.21,38.48 29.21,37.21 25.27,33.27 25.27,32.26 v26.67,30.86 | v38.35,30.99 38.35,33.03 CAM1.3
N$23
  Top 0.381: C14.A 14.48,20.45 13.46,19.43 13.46,18.8 14.12,18.14 IC1.2
N$24
  Top 0.381: C6.C 17.65,14.99 17.1,15.54 IC1.6
N$25
  Top 0.381: R5.1 106.68,40.64 107.95,41.91 R6.1 107.95,45.47 106.68,46.74 IC3.14
N$26
  Top 0.381: R10.1 97.35,65.28 U$5.P$2
N$27  (via drill 0.51)
  Top 0.381: IC3.16 106.93,49.28 v107.95,48.26
  Bottom 0.381: v107.95,48.26 107.95,46.86 R7.1
N$28
  Top 0.381: R9.2 38.99,61.31 LED1.A
N$29
  Top 0.381: R8.1 110.36,48.13 109.22,46.99 107.82,46.99 106.81,48.01 IC3.15
N$30
  Top 0.381: R8.2 108.33,53.85 107.57,53.09 IC3.19
N$31
  Top 0.381: R13.1 91.94,53.85 92.71,53.09 IC3.2
N$32
  Top 0.381: IC3.7 91.95,46.74 89.66,49.02 R13.2
N$33  (via drill 0.51)
  Top 0.381: IC3.6 v92.71,48.01
  Bottom 0.381: R12.2 90.29,43.94 92.71,46.35 v92.71,48.01
N$34  (via drill 0.51)
  Top 0.381: R11.2 92.46,44.45 93.34,45.34 95.05,45.34 IC3.8 97.28,45.47 97.54,45.72 v97.79,45.72 | R10.2 96.78,62.48 v101.6,57.66
  Bottom 0.381: v97.79,45.72 99.95,45.72 101.41,47.18 101.6,47.37 v101.6,57.66
N$35  (via drill 0.51)
  Top 0.381: R5.2 91.94,40.64 R11.1 v87.63,44.96 | IC3.4 v92.33,50.55
  Bottom 0.381: v92.33,50.55 91.31,50.55 90.04,49.28 R12.1 88.65,46.74 87.63,45.72 v87.63,44.96
N$36  (via drill 0.38)
  Top 0.254: v37.08,45.47 41.78,45.47 49.37,37.88 U$7.163
  Bottom 0.254: v37.08,45.47 37.08,45.34 36.2,44.45 36.2,40.34 CAM1.11
N$37  (via drill 0.38)
  Top 0.254: v37.08,43.94 37.97,44.83 41.66,44.83 49.11,37.38 U$7.164
  Bottom 0.254: v37.08,43.94 37.08,40.35 CAM1.12
N$38  (via drill 0.38)
  Top 0.254: v40.13,43.81 41.78,43.81 48.72,36.88 U$7.165
  Bottom 0.254: v40.13,43.81 39.12,43.81 38.03,42.73 CAM1.13
N$39  (via drill 0.38)
  Top 0.254: U$7.166 47.82,36.38 v41.4,42.8
  Bottom 0.254: v41.4,42.8 40.26,42.8 38.93,41.47 CAM1.14
N$40  (via drill 0.38)
  Top 0.254: v44.45,37.85 45.59,37.85 47.56,35.88 U$7.167
  Bottom 0.254: v44.45,37.85 41.87,37.85 CAM1.17
N$41  (via drill 0.38)
  Top 0.254: U$7.168 46.92,35.38 v45.47,36.83
  Bottom 0.254: v45.47,36.83 41.9,36.83 CAM1.18
N$42  (via drill 0.38)
  Top 0.254: U$7.171 46.76,33.88 v45.09,35.56
  Bottom 0.254: CAM1.19 44.64,36 v45.09,35.56
N$43  (via drill 0.38)
  Top 0.254: U$7.172 45.87,33.38 v44.96,34.29
  Bottom 0.254: v44.96,34.29 44.15,35.1 CAM1.20
N$44  (via drill 0.38)
  Top 0.254: U$7.175 27.68,31.88 v26.67,32.89
  Bottom 0.254: v26.67,32.89 32.08,38.3 CAM1.10
N$45  (via drill 0.38)
  Top 0.254: v29.84,29.84 42.16,29.84 43.7,31.38 U$7.176
  Bottom 0.254: v29.84,29.84 29.08,29.84 28.45,30.48 28.45,33.02 31.93,36.5 CAM1.8
N$46  (via drill 0.38)
  Top 0.254: v27.81,29.59 28.83,28.57 42.55,28.57 44.85,30.88 U$7.177
  Bottom 0.254: v27.81,29.59 27.81,33.27 31.94,37.4 CAM1.9
N$47  (via drill 0.38)
  Top 0.254: v41.27,27.18 42.8,27.18 46,30.38 U$7.178
  Bottom 0.254: v41.27,27.18 40.39,27.18 39.37,28.19 39.37,33.06 CAM1.2
N$48  (via drill 0.38)
  Top 0.254: v37.59,16.64 41.56,12.67 U$7.1
  Bottom 0.254: v37.59,16.64 37.59,16.76 37.47,16.89 37.47,25.02 | 37.47,25.02 37.47,33.04 CAM1.4 | R34.1 37.47,25.02
N$49  (via drill 0.38)
  Top 0.254: U$7.208 40.63,15.38 38.92,17.08 | 38.92,17.08 38.9,17.11 | 38.9,17.11 v36.58,19.43 | 38.9,17.11 38.9,17.12 | v39.88,18.16 39.88,18.03 38.92,17.08
  Bottom 0.254: v36.58,19.43 36.07,19.94 36.07,31.75 36.63,32.31 CAM1.5 | R33.1 v39.88,18.16
N$50
  Top 0.254: C21.2 | C21.2 54.61,54.61 | C21.2 56.39,52.96 300-8444-ND.1 56.64,52.83 58.95,50.52 U$7.149
N$51
  Top 0.254: 54.99,48.77 C20.2 56.52,50.42 300-8444-ND.2 56.77,50.42 58.45,48.74 U$7.150
N$52
  Top 0.254: C56.1 61.47,2.41 535-9034-ND.1 65.34,6.29 76.96,6.29 77.95,7.27 U$7.46
  Bottom 0.254: C56.1 535-9034-ND.1
N$53
  Top 0.254: C55.1 61.34,8.38 535-9034-ND.2 63.31,6.79 76.64,6.79 77.45,7.6 U$7.45
  Bottom 0.254: C55.1 535-9034-ND.2
N$54  (via drill 0.38)
  Top 0.254: CON1.5 R14.1 95.51,27.69 94.49,26.67 88.46,26.67 86.93,25.15 86.87,4.95 84.45,2.54 69.34,2.54 v68.07,3.81 | U$7.30 69.95,9.56 v68.07,7.68
  Bottom 0.254: v68.07,3.81 v68.07,7.68
N$55  (via drill 0.38)
  Top 0.254: CON1.7 R15.1 95.51,25.15 94.23,23.88 89.03,23.88 87.5,22.35 87.5,3.94 85.09,1.52 v70.61,1.52 | v69.31,7.68 70.45,8.83 U$7.31
  Bottom 0.254: v69.31,7.68 69.31,2.79 69.34,2.79 v70.61,1.52
N$56  (via drill 0.38)
  Top 0.254: CON1.9 96.27,22.86 95.5,22.35 95.5,22.1 R16.1 95.51,21.72 94.23,20.45 91.57,20.45 90.17,19.05 90.17,4.06 v88.52,2.41 | U$7.34 71.95,8.76 v70.87,7.68
  Bottom 0.254: v88.52,2.41 72.26,2.41 70.87,3.81 v70.87,7.68
N$57  (via drill 0.38)
  Top 0.254: v66.04,5.4 66.8,4.64 81.15,4.64 82.55,6.03 v82.55,9.08 | U$7.29 69.45,11.09 v66.04,7.68
  Bottom 0.254: v66.04,5.4 v66.04,7.68 | CON1.13 93.47,10.92 84.39,10.92 v82.55,9.08
N$58  (via drill 0.38)
  Top 0.254: CON1.3 89.79,30.48 86.3,27.05 86.3,5.91 83.82,3.43 v77.22,3.43 | v72.01,7.68 72.45,8.13 U$7.35
  Bottom 0.254: v77.22,3.43 72.9,3.43 72.01,4.32 v72.01,7.68
N$59  (via drill 0.51)
  Top 0.381: v42.55,33.15 43.43,34.04 v43.43,38.73 39.24,42.93 34.16,42.93 30.35,46.74 29.08,46.74 | SJ1.1 29.08,46.74 | SJ2.1 28.77,47.05 29.08,46.74
  Bottom 0.254: R34.2 42.55,25.02 v42.55,33.15 43.43,33.15 44.45,32.13 44.45,23.94 42.67,22.16 R33.2
  Bottom 0.381: v43.43,38.73 41.86,38.73 CAM1.16 | v42.55,33.15 40.27,33.15 CAM1.1
N$60
  Top 0.381: L1.1 22.77,52.27 U$14_LM3671MF-2.8.P$5
N$61
  Top 0.381: U$16_LM3671MF-1.8.P$5 16.07,36.26 16.89,37.08 18.49,37.08 L2.1
N$62
  Top 0.381: L3.1 10.83,52.4 U$17_LM3671-1.5.P$5
N$63
  Top 0.254: C54.1 53.59,44.32 54.42,45.15 R18.1 | 54.74,46.35 R18.1 | U$7.154 56.45,45.91 55.75,46.61 R18.1
N$64
  Top 0.254: R18.2 C29.1
N$65  (via drill 0.38)
  Top 0.254: R19.2 v64.39,10.35 | U$7.49 79.45,10.87 v78.93,10.35
  Bottom 0.254: v78.93,10.35 v64.39,10.35
N$66
  Top 0.508: J2.VIN0 3.56,70.48 4.83,71.75 U$15.P$1
N$67  (via drill 0.38)
  Top 0.254: R22.2 v27.69,16.51 | v25.78,17.78 24.32,16.32 24.26,16.26 24.19,16.18 IC1.12
  Bottom 0.254: v27.69,16.51 27.05,16.51 v25.78,17.78
N$68
  Top 0.381: C60.A 90.43,64.01 C58.1 R21.2 R20.1 92.58,58.55 92.71,58.55 94.36,56.9 96.65,56.9 98.93,54.61 98.93,52.83 | IC3.3 97.92,51.82 98.93,52.83 | 99.69,49.28 IC3.5 | IC3.12 101.6,44.2 100.97,44.83 99.69,44.83 | IC3.10 98.55,42.93 99.69,44.07 99.69,44.83 | 99.69,49.28 99.69,52.07 98.93,52.83 | 99.69,49.28 101.6,49.28 102.87,50.55 IC3.17 | 99.69,49.28 99.69,44.83 | IC3.9 98.04,44.2 98.68,44.83 99.69,44.83
N$69
  Top 0.381: R23.2 8.35,27.82 X1.5
N$70  (via drill 0.38)
  Top 0.254: U$7.2 55.95,14.35 55.5,14.8 44.51,14.8 v43.69,13.97 | v43.69,10.35 R32.1
  Bottom 0.254: v43.69,13.97 v43.69,10.35
N$71
  Top 0.254: R24.2 25.84,15.11 24.97,14.23 IC1.9
N$72
  Top 0.254: R32.2 41.42,6.09 LED2.A
N$73
  Bottom 0.508: 0,100.33 119.38,100.33 119.38,0 0,0 0,100.33
N$74
  Top 0.508: 0,100.33 119.38,100.33 119.38,0 0,0 0,100.33
N$80  (via drill 0.38)
  Top 0.254: S1.1 S1.2 27.79,7.34 R17.2 39.62,12.7 40.7,11.62 v52.9,11.62 | U$7.36 72.95,9.16 v73.34,8.76
  Bottom 0.254: 63.44,8.76 63.5,8.76 | 63.5,8.76 v73.34,8.76 73.47,8.76 74.42,7.81 92.9,7.81 CON1.15 | v52.9,11.62 60.64,11.62 63.5,8.76
RB0
  Top 0.254: R26.1 JP14.1 46.99,92.71 48.26,91.44 50.29,91.44 51.75,89.98 U$1.P$16
RB1
  Top 0.254: R27.1 JP14.2 52.25,90.25 U$1.P$15
RB2
  Top 0.254: R28.1 JP14.3 52.07,91.44 52.75,90.76 U$1.P$14
RB3
  Top 0.254: R29.1 JP14.4 53.25,91.6 U$1.P$13
RB4
  Top 0.254: R30.1 JP14.5 57.15,92.71 55.88,91.44 54.48,91.44 53.75,90.71 U$1.P$12
RB5
  Top 0.254: R31.1 JP14.6 58.42,91.69 57.4,91.69 56.64,90.93 54.74,90.93 54.25,90.44 U$1.P$11
RD4  (via drill 0.38)
  Top 0.254: U$1.P$52 63.59,80.81 65.47,78.93 71.56,78.93 v72.07,79.44
  Bottom 0.254: v72.07,79.44 72.07,79.45 U$2.9
RD5  (via drill 0.38)
  Top 0.254: U$1.P$53 60.1,81.31 59.69,80.9 59.69,79.25 61.21,77.72 61.21,73.15 60.45,72.39 59.31,72.39 51.82,64.9 48.13,64.9 41.02,57.78 v40.77,57.78 | U$9.P$3 30.91,51.9 v30.86,51.94
  Bottom 0.254: v30.86,51.94 34.92,51.94 v40.77,57.78
RD6  (via drill 0.38)
  Top 0.254: U$1.P$54 64.31,81.81 66.29,79.82 v70.99,79.82 | v83.82,60.96 83.82,52.9 81.41,50.48 71.69,50.48 70.93,49.72 70.93,48.91 U$6.P$3
  Bottom 0.254: v70.99,79.82 70.99,76.58 72.2,75.37 75.63,75.37 83.88,67.12 83.88,61.02 v83.82,60.96
RD7
  Top 0.254: U$1.P$55 66.03,82.31 JP7.1
RTSDATA  (via drill 0.38)
  Top 0.254: X1.7 7.35,24.02 8.51,22.86 8.51,20.19 v10.41,18.29 | v13.46,14.22 16.12,14.22 IC1.8
  Bottom 0.254: v10.41,18.29 10.41,17.27 v13.46,14.22
RXDATA  (via drill 0.38)
  Top 0.254: IC1.13 23.31,16.84 25.53,19.05 25.53,23.37 v25.02,23.88
  Bottom 0.254: v25.02,23.88 6.75,23.88 X1.3
SCL1  (via drill 0.38)
  Top 0.254: U$1.P$44 57.25,75.15 v57.59,74.8 | v74.55,74.49 66.67,74.49 65.72,75.44 v65.02,75.44 | JP4_ITG-3200.7 79.63,67.75 80.83,66.55 | 80.83,66.55 80.83,55.44 v80.33,54.93 | 80.83,66.55 84.84,66.55 90.55,72.26 109.09,72.26 JP5_MMA8452Q.3
  Bottom 0.254: v57.59,74.8 63.56,74.8 64.2,75.44 v65.02,75.44 | v74.55,74.49 74.55,71.56 75.63,70.48 78.23,70.48 79.63,69.09 JP4_ITG-3200.7 | v80.33,54.93 76.9,54.93 JP6_MAG3110.4
SDA1  (via drill 0.38)
  Top 0.254: U$1.P$43 56.77,77.34 56.77,74.3 v57.21,73.85 | v64.39,74.42 65.34,74.42 66.04,73.72 v73.53,73.72 | 79.38,65.53 v79.38,55.69 | JP4_ITG-3200.6 79.38,65.53 | 79.38,65.53 v80.07,65.53 | v82.42,65.53 84.52,65.53 90.74,71.63 111,71.63 JP5_MMA8452Q.2
  Bottom 0.254: v73.53,73.72 73.53,71.37 JP4_ITG-3200.6 | v64.39,74.42 63.82,73.85 v57.21,73.85 | v79.38,55.69 75.12,55.69 JP6_MAG3110.3 | v80.07,65.53 v82.42,65.53
SPIO_MISO  (via drill 0.38)
  Top 0.254: U$1.P$51 62.44,80.31 63.37,79.38 63.37,71.5 61.09,69.22 v61.09,62.87 | v61.98,57.91 61.53,57.47 v56.96,57.47 | v49.15,26.8 49.78,27.43 49.78,28.83 50.84,29.88 U$7.179
  Bottom 0.254: v61.09,62.87 61.09,61.98 61.98,61.09 v61.98,57.91 | v49.15,26.8 48.77,27.18 48.77,27.81 50.55,29.59 50.55,42.16 53.98,45.59 59.88,45.59 61.02,46.74 61.02,53.28 56.96,57.34 v56.96,57.47
SPIO_MOSI  (via drill 0.38)
  Top 0.254: U$1.P$50 62.18,79.81 62.87,79.12 62.87,71.88 60.45,69.47 60.45,63.25 59.69,62.48 v59.69,61.59 | v61.21,59.31 61.21,58.8 60.71,58.29 54.74,58.29 v54.1,57.66 | v49.91,25.91 49.91,26.67 50.29,27.05 50.29,28.57 51.1,29.38 U$7.180
  Bottom 0.254: v59.69,61.59 61.21,60.07 v61.21,59.31 | v54.1,57.66 54.48,57.28 55.75,57.28 60.52,52.51 60.52,46.99 59.63,46.1 53.72,46.1 50.04,42.42 50.04,29.84 48.26,28.07 48.26,26.54 48.9,25.91 v49.91,25.91
SPIO_SPCK  (via drill 0.38)
  Top 0.254: U$1.P$49 61.79,79.31 62.36,78.74 62.36,72.14 59.94,69.72 59.94,63.5 v58.29,61.85 | v52.32,57.91 53.21,58.8 59.69,58.8 v60.07,59.18 | 53.21,28.89 53.09,28.89 53.1,28.88 U$7.181 53.24,28.89 51.37,28.89 50.93,28.45 50.93,25.27 v50.55,24.89
  Bottom 0.254: v58.29,61.85 58.29,60.96 v60.07,59.18 | v52.32,57.91 52.32,56.39 53.09,55.63 55.88,55.63 59.94,51.56 59.94,47.18 59.37,46.61 53.47,46.61 49.53,42.67 49.53,30.1 47.75,28.32 47.75,25.91 49.15,24.51 50.16,24.51 v50.55,24.89
TXDATA  (via drill 0.38)
  Top 0.254: IC1.14 23.07,17.48 24.64,19.05 v24.64,22.61
  Bottom 0.254: X1.2 24.61,22.63 v24.64,22.61
U2CTS_L  (via drill 0.38)
  Top 0.254: v25.4,34.67 25.4,29.21 27.94,26.67 27.94,24.77 31.75,20.95 R24.1 | v27.56,37.34 30.61,40.39 v30.61,42.42 | v48.77,58.42 v48.77,60.71 | U$1.P$21 48.74,84.81 47.88,83.95 47.88,81.41 46.23,79.76 v46.23,78.99
  Bottom 0.254: v25.4,34.67 25.4,35.18 v27.56,37.34 | v30.61,42.42 30.61,43.05 43.18,55.63 45.72,55.63 46.23,56.13 46.23,57.02 46.74,57.53 47.88,57.53 v48.77,58.42 | v48.77,60.71 46.1,63.37 46.1,65.53 47.5,66.93 47.5,71.63 46.23,72.9 v46.23,78.99
U2RTS_L  (via drill 0.38)
  Top 0.254: IC1.10 24.79,14.88 27.3,17.4 27.3,23.5 26.04,24.77 26.04,26.8 24.13,28.7 24.13,32.26 22.1,34.29 22.1,35.43 v22.99,36.32 | v25.27,39.12 v28.19,42.04 | v44.96,58.42 46.1,59.56 v46.1,60.33 | v46.74,70.74 46.74,72.01 47.12,72.39 47.12,79.25 48.68,80.81 U$1.P$29
  Bottom 0.254: v22.99,36.32 25.27,38.61 v25.27,39.12 | v28.19,42.04 28.19,42.8 29.34,43.94 29.59,43.94 42.16,56.52 42.16,57.02 42.42,57.28 43.81,57.28 v44.96,58.42 | v46.1,60.33 46.1,61.34 45.21,62.23 45.21,65.91 46.74,67.44 v46.74,70.74
U2RX  (via drill 0.38)
  Top 0.254: v23.88,33.78 24.77,32.89 24.77,28.96 26.92,26.8 26.92,24.77 29.72,21.97 R22.1 | v26.92,38.73 29.46,41.27 v29.46,42.93 | v46.74,58.42 47.24,58.93 47.24,60.96 v48.51,62.23 | U$1.P$31 48.69,79.81 47.75,78.87 47.75,72.77 v48.26,72.26
  Bottom 0.254: v23.88,33.78 23.24,34.42 23.24,35.05 v26.92,38.73 | v48.51,62.23 48.51,62.36 46.86,64.01 46.86,65.02 48.26,66.42 v48.26,72.26 | v46.74,58.42 45.59,57.28 45.59,56.39 45.34,56.13 42.67,56.13 v29.46,42.93
U2TX  (via drill 0.38)
  Top 0.254: IC1.11 24.68,15.54 26.67,17.53 26.67,23.37 25.4,24.64 25.4,26.42 23.5,28.32 23.5,32 21.34,34.16 21.34,36.58 v21.97,37.21 | v23.88,39.12 28.45,43.69 v28.45,44.45 | v43.43,58.55 44.07,59.18 44.07,59.82 46.35,62.1 46.99,62.1 v48.51,63.63 | U$1.P$32 49.34,79.31 48.64,78.61 48.64,73.66 v49.28,73.03
  Bottom 0.254: v21.97,37.21 v23.88,39.12 | v48.51,63.63 49.28,64.39 v49.28,73.03 | v43.43,58.55 42.8,58.55 41.15,56.9 41.15,56.26 40.77,55.88 40.39,55.88 30.1,45.59 29.59,45.59 v28.45,44.45
VBUS  (via drill 0.38, 0.51)
  Top 0.254: U$1.P$34 52.25,76.38 51.82,75.95 v50.29,75.95 | v31.11,82.55 26.92,82.55 25.91,81.53 12.19,81.53 9.91,83.82 v7.62,83.82
  Top 0.508: U$15.P$2 C10.1 v18.92,66.29 | X2.VBUS 5.87,82.07 v7.62,83.82
  Bottom 0.254: v31.11,82.55 45.85,82.55 49.53,78.87 49.53,76.71 v50.29,75.95
  Bottom 0.508: v7.62,83.82 7.62,77.6 v18.92,66.29
VCC  (via drill 0.38)
  Top 0.254: JP5.1 18.54,43.18 29.21,32.51 31.24,32.51 v32.64,33.91
  Top 0.381: U$17_LM3671-1.5.P$4 10.83,49.2 L3.2 12.83,49.07 C52.2 12.83,45.59 JP5.1
  Bottom 0.254: CAM1.6 33.43,34.7 v32.64,33.91

## Text on the board
tPlace: U1 | U2 | MMA8452Q | ITG-3200 | U5 | U15 | U5 | 18.432MHz | U14 | U17 | U9 | U16 | Spring 2012 | VIPER GROUP1 PCB1 | 32.768KHz
bPlace: MAG3110 | 3/9/2012 | Aaron Garrett | Brendon McCool | Justin Huffaker | Ryan Hannah